# Altium schematic sheet TOP.SchDoc: TOP
size 420 x 297 mm; Author: P. Zdunek; CompanyName: WUT ISE; DrawnBy: P. Zdunek; Organization: WUT ISE; Address1: PW ISE; Address2: Nowowiejska 15/19 00-665 Warsaw; Address3: p.zdunek90@gmail.com; DocumentNumber: 1; Revision: 2; SheetNumber: 1; SheetTotal: 10; ModifiedBy: -; CheckedDate: -; DivGrp: WUT ISE; Designer: P. Zdunek; ModifiedDate: -; ProjectName: Sensor Box
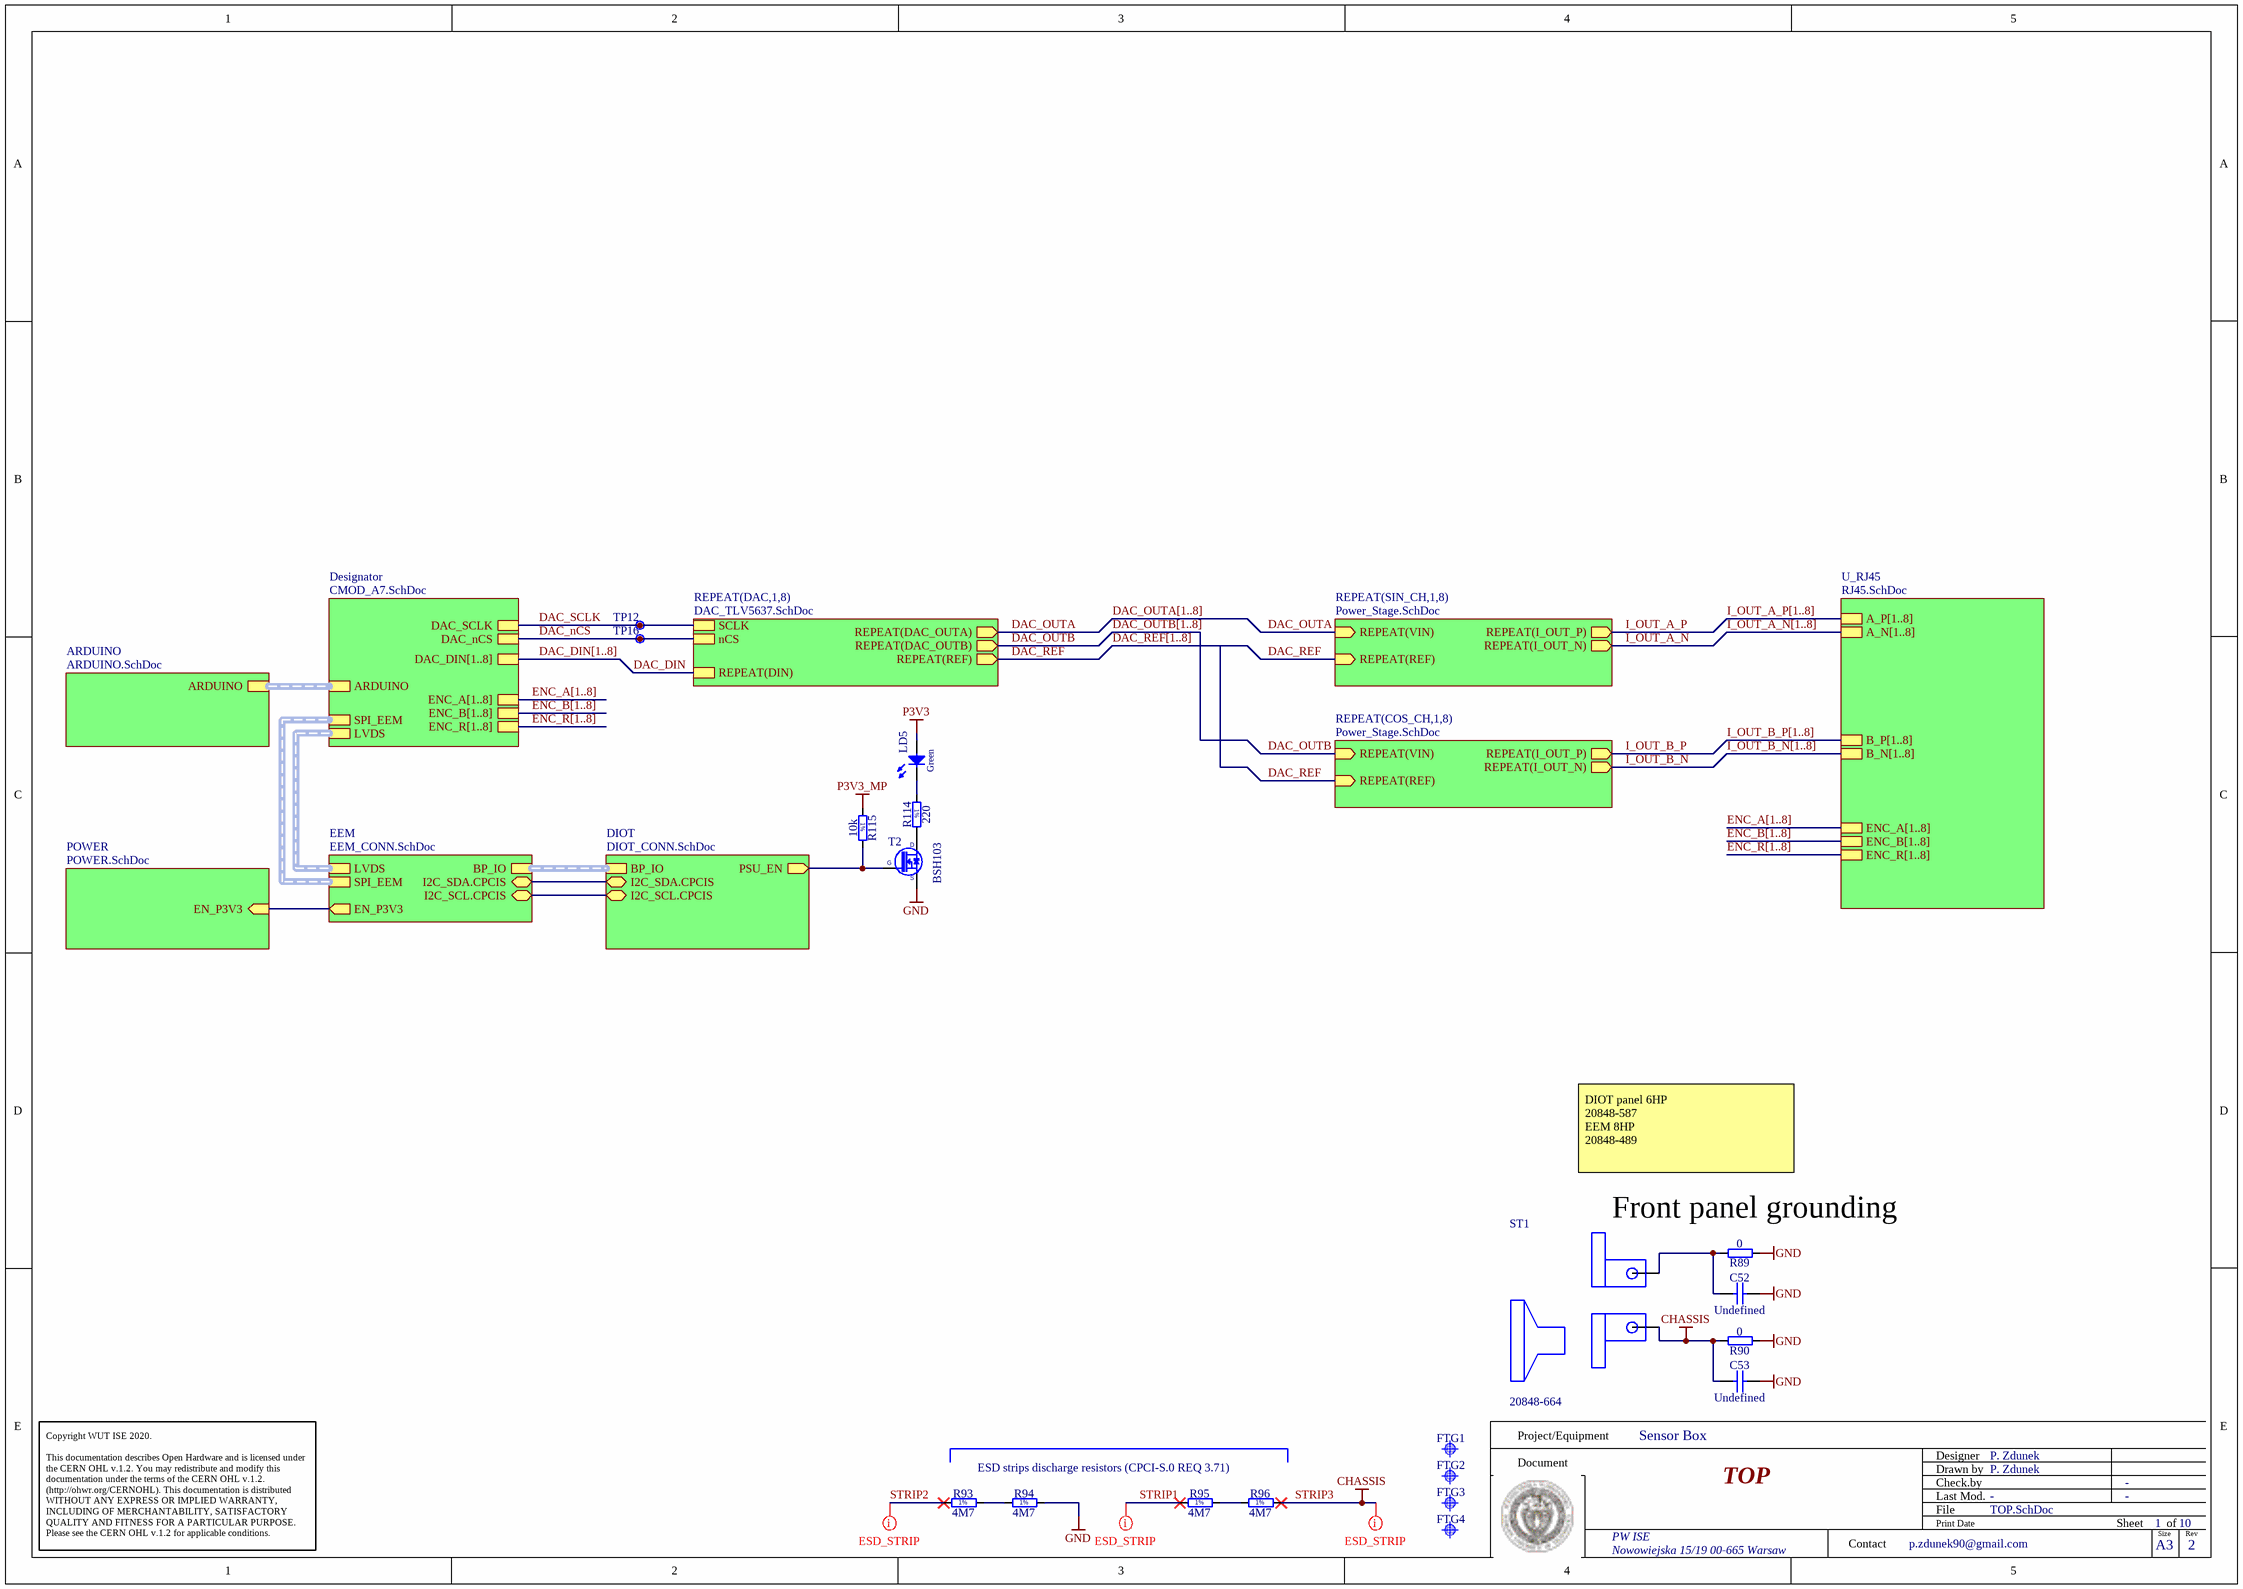
[diagram p0: TOP.SchDoc]

## Parts
C52  Undefined  [CAPC2012X135N]
C53  Undefined  [CAPC2012X135N]
FTG1  Use only in PCB  [FIDUCIAL_TOP_C100-200]  (value not drawn)  (no BOM)
FTG2  Use only in PCB  [FIDUCIAL_TOP_S100-200]  (value not drawn)  (no BOM)
FTG3  Use only in PCB  [FIDUCIAL_TOP_S100-200]  (value not drawn)  (no BOM)
FTG4  Use only in PCB  [FIDUCIAL_TOP_S100-200]  (value not drawn)  (no BOM)
LD5  Green  [LED_DIALIGHT_555-230]
R89  0  [RESC1005X40N]
R90  0  [RESC1005X40N]
R93  4M7  [RESC2113X55N]
R94  4M7  [RESC2113X55N]
R95  4M7  [RESC2113X55N]
R96  4M7  [RESC2113X55N]
R114  220  [RESC1608X55N]
R115  10k  [RESC1005X40N]
ST1  Manufacturer Part Number 2: 20848-664  [SCHROFF_PANEL_3HP_4U]  (no BOM)
T2  BSH103  [SOT95P230X110-3N]
TP12  Plated Hole  [c130h60]  (value not drawn)  (no BOM)
TP16  Plated Hole  [c130h60]  (value not drawn)  (no BOM)

## Sub-sheets
ARDUINO = ARDUINO.SchDoc: ARDUINO (harness Harness)
Designator = CMOD_A7.SchDoc: DAC_DIN[1..8], ENC_A[1..8], ENC_B[1..8], ENC_R[1..8], DAC_SCLK, DAC_nCS, ARDUINO (harness Harness), SPI_EEM (harness Harness), LVDS (harness Harness)
DIOT = DIOT_CONN.SchDoc: BP_IO (harness BP_Conn), I2C_SDA.CPCIS (bidir), I2C_SCL.CPCIS (bidir), PSU_EN (out)
EEM = EEM_CONN.SchDoc: I2C_SDA.CPCIS (bidir), I2C_SCL.CPCIS (bidir), BP_IO (harness BP_Conn), SPI_EEM (harness Harness), LVDS (harness Harness), EN_P3V3 (out)
POWER = POWER.SchDoc: EN_P3V3 (in)
REPEAT(COS_CH,1,8) = Power_Stage.SchDoc: REPEAT(I_OUT_P) (out), REPEAT(I_OUT_N) (out), REPEAT(VIN) (in), REPEAT(REF) (in)
REPEAT(DAC,1,8) = DAC_TLV5637.SchDoc: SCLK, REPEAT(DIN), nCS, REPEAT(DAC_OUTA) (out), REPEAT(DAC_OUTB) (out), REPEAT(REF) (out)
REPEAT(SIN_CH,1,8) = Power_Stage.SchDoc: REPEAT(I_OUT_P) (out), REPEAT(I_OUT_N) (out), REPEAT(VIN) (in), REPEAT(REF) (in)
U_RJ45 = RJ45.SchDoc: A_P[1..8], A_N[1..8], B_P[1..8], B_N[1..8], ENC_B[1..8], ENC_R[1..8], ENC_A[1..8]

## Nets
GND: C52.2 C53.2 R89.1 R90.1 R94.2 T2.2(S)
P3V3: LD5.2(A)
P3V3_MP: R115.1
STRIP3: C53.1 R90.2 R96.2 ST1.0  [also labelled CHASSIS]
DAC_DIN: sheet REPEAT(DAC,1,8)/REPEAT(DIN)
DAC_nCS: TP16.1 ; sheet REPEAT(DAC,1,8)/nCS, sheet Designator/DAC_nCS
DAC_OUTA: sheet REPEAT(DAC,1,8)/REPEAT(DAC_OUTA), sheet REPEAT(SIN_CH,1,8)/REPEAT(VIN)
DAC_OUTB: sheet REPEAT(DAC,1,8)/REPEAT(DAC_OUTB), sheet REPEAT(COS_CH,1,8)/REPEAT(VIN)
DAC_REF: sheet REPEAT(DAC,1,8)/REPEAT(REF), sheet REPEAT(SIN_CH,1,8)/REPEAT(REF), sheet REPEAT(COS_CH,1,8)/REPEAT(REF)
DAC_SCLK: TP12.1 ; sheet REPEAT(DAC,1,8)/SCLK, sheet Designator/DAC_SCLK
I_OUT_A_N: sheet REPEAT(SIN_CH,1,8)/REPEAT(I_OUT_N)
I_OUT_A_P: sheet REPEAT(SIN_CH,1,8)/REPEAT(I_OUT_P)
I_OUT_B_N: sheet REPEAT(COS_CH,1,8)/REPEAT(I_OUT_N)
I_OUT_B_P: sheet REPEAT(COS_CH,1,8)/REPEAT(I_OUT_P)
STRIP1: R95.1
STRIP2: R93.1
NetC52_1: C52.1 R89.2 ST1.1
NetLD5_1: LD5.1(C) R114.1
NetR93_2: R93.2 R94.1
NetR95_2: R95.2 R96.1
NetR114_2: R114.2 T2.3(D)
NetR115_2: R115.2 T2.1(G) ; sheet DIOT/PSU_EN
(unnamed): sheet EEM/I2C_SDA.CPCIS, sheet DIOT/I2C_SDA.CPCIS
(unnamed): sheet EEM/I2C_SCL.CPCIS, sheet DIOT/I2C_SCL.CPCIS
(unnamed): sheet EEM/EN_P3V3, sheet POWER/EN_P3V3

## Buses and harness runs
bus DAC_DIN[1..8] = sheet Designator/DAC_DIN[1..8]
bus DAC_OUTA[1..8]
bus DAC_OUTB[1..8]
bus DAC_REF[1..8]
bus ENC_A[1..8] = sheet Designator/ENC_A[1..8]
bus ENC_A[1..8] = sheet U_RJ45/ENC_A[1..8]
bus ENC_B[1..8] = sheet Designator/ENC_B[1..8]
bus ENC_B[1..8] = sheet U_RJ45/ENC_B[1..8]
bus ENC_R[1..8] = sheet Designator/ENC_R[1..8]
bus ENC_R[1..8] = sheet U_RJ45/ENC_R[1..8]
bus I_OUT_A_N[1..8] = sheet U_RJ45/A_N[1..8]
bus I_OUT_A_P[1..8] = sheet U_RJ45/A_P[1..8]
bus I_OUT_B_N[1..8] = sheet U_RJ45/B_N[1..8]
bus I_OUT_B_P[1..8] = sheet U_RJ45/B_P[1..8]
harness sheet ARDUINO/ARDUINO = sheet Designator/ARDUINO
harness sheet Designator/LVDS = sheet EEM/LVDS
harness sheet Designator/SPI_EEM = sheet EEM/SPI_EEM
harness sheet DIOT/BP_IO = sheet EEM/BP_IO

## Layout directives
net class ESD_STRIP: STRIP1, STRIP2, STRIP3

## Notes on the sheet
- DIOT panel 6HP
  20848-587
  EEM 8HP
  20848-489
- (near R89) Front panel grounding
- ESD strips discharge resistors (CPCI-S.0 REQ 3.71)
- Project/Equipment
- Document
- Designer
- Drawn by
- Check.by
- Copyright WUT ISE 2020.
  This documentation describes Open Hardware and is licensed under the CERN OHL v.1.2. You may redistribute and modify this documentation under the terms of the CERN OHL v.1.2. (http://ohwr.org/CERNOHL). This documentation is distributed WITHOUT ANY EXPRESS OR IMPLIED WARRANTY, INCLUDING OF MERCHANTABILITY, SATISFACTORY QUALITY AND FITNESS FOR A PARTICULAR PURPOSE. Please see the CERN OHL v.1.2 for applicable conditions.
- Contact
- File
- Last Mod.
- Print Date
- Sheet
- Size
- A3
- of
- Rev
- (in symbol R0402_10K_1%_0.0625W_100PPM) 1%
- (in symbol R0603_220R_1%_0.1W_100PPM) 1%
- (in symbol R0805_4M7_1%_0.125W_100PPM_VISHAY_CRCW e3) 1%

## Library data of the parts
C52 C53 = CC0805_NO-VALUE: Non-polarised capacitor; Part Description: Reserved Footprint For 0805(2012) Chip Ceramic Capacitor; Mounted: No; Part Number: CC0805_NO-VALUE; Component Kind: Standard; Component Type: Standard; Pin Count: 2; Value: Undefined; Status: None; Manufacturer: Undefined; Manufacturer Part Number: CC0805_NO-VALUE; Case: 0805; Socket: No; SMD: Yes; Sense: No; Manufacturer1 ComponentHeight: 1.35mm; HelpURL: Undefined; Author: CERN DEM JLC; CreateDate: 10.12.2008; LatestRevisionDate: 11.09.2013
FTG1 = FIDUCIAL_TARGET_C100-200: Fiducial Target; Part Description: Round Fiducial Target, Top Layer, 1.0mm, Top Solder 2.0mm, Keepout =2.0mm; Mounted: No; Part Number: FIDUCIAL_TARGET_C100-200; Component Type: Standard (No BOM); Pin Count: 1; Family: Fiducial; Socket: No; SMD: Yes; Sense: No; Status: None; ComponentHeight: 0mm; HelpURL: Undefined; Author: CERN DEM JLC; CreateDate: 09.02.2010; LatestRevisionDate: 04.04.2012; PackageDescription: Round Fiducial Target, Top Layer, 1.0mm, Top Solder 2.0mm, Keepout =2.0mm
FTG2-FTG4 = FIDUCIAL_TARGET_S100-200: Fiducial Target; Part Description: Square Fiducial Target, Top Layer, 1.0mm, Top Solder 2.0mm, Keepout =2.0mm; Mounted: No; Part Number: FIDUCIAL_TARGET_S100-200; Component Type: Standard (No BOM); Pin Count: 1; Family: Fiducial; Socket: No; SMD: Yes; Sense: No; Status: None; ComponentHeight: 0mm; HelpURL: Undefined; Author: CERN DEM JLC; CreateDate: 09.02.2010; LatestRevisionDate: 04.04.2012; PackageDescription: Square Fiducial Target, Top Layer, 1.0mm, Top Solder 2.0mm, Keepout =2.0mm
LD5 = LED_DIALIGHT_555-2301F: LED Green 1C 2A; Part Description: Single 2mm Green LED CBI® Circuit Board Indicator; PressFit: No; Bonding: No; Part Number: LED_DIALIGHT_555-2301F; Component Kind: Standard; Component Type: Standard; Color: Green; PackageDescription: Single 2mm Green LED, Body 5.08x2.54mm, Pin spacing 2.54mm; Manufacturer: DIALIGHT; Manufacturer Part Number: 555-2301F; Pin Count: 2; Mounted: Yes; Socket: No; SMD: No; Sense: No; ComponentHeight: 6.35mm; HelpURL: \\cern.ch\dfs\Applications\Altium\Datasheets\LED_DIALIGHT_555-2301F.pdf; Author: CERN DEM JMW; CreateDate: 22.09.2008; LatestRevisionDate: 17.03.2010
R89 R90 = R0402_0R_JUMPER: Resistor; Part Description: 1A (0.05R Max DC Resistance) Zero Ohm Jumper; Manufacturer: GENERIC; Manufacturer1 Part Number: 232270591001L; PressFit: No; Part Number: R0402_0R_JUMPER; Component Kind: Standard; Component Type: Standard; Pin Count: 2; Value: 0; Status: Not Recommended; Manufacturer Part Number: R0402_0R_JUMPER; Case: 0402; Mounted: Yes; Sense: No; Socket: No; SMD: Yes; Manufacturer1 Example: YAGEO PHYCOMP; Manufacturer1 ComponentHeight: 0.4mm; HelpURL: \\cern.ch\dfs\Applications\Altium\Datasheets\R0402_Phycomp_RC0402.pdf; Author: CERN DEM JLC; CreateDate: 03/12/2007; LatestRevisionDate: 17/10/2012
R93-R96 = R0805_4M7_1%_0.125W_100PPM_VISHAY_CRCW e3: Resistor - 1%; Part Description: 150V, Standard Thick Film Chip Resistor; Manufacturer: VISHAY; Manufacturer Part Number: CRCW08054M70FKEA; Power: 0.125W; TC: ±100ppm/°C; PressFit: No; Part Number: R0805_4M7_1%_0.125W_100PPM_VISHAY_CRCW e3; Component Kind: Standard; Component Type: Standard; Pin Count: 2; Value: 4M7; Status: None; Tolerance: ±1%; Case: 0805; Mounted: Yes; Sense: No; Socket: No; SMD: Yes; ComponentHeight: 0.5mm; HelpURL: \\cern.ch\dfs\Applications\Altium\Datasheets\R0805_VISHAY_CRCW e3.pdf; Author: CERN DEM BR; CreateDate: 27/05/2019; LatestRevisionDate: 27/05/2019
R114 = R0603_220R_1%_0.1W_100PPM: Resistor - 1%; Part Description: General Purpose Thick Film Chip Resistor; Manufacturer: GENERIC; Manufacturer1 Part Number: NRC06F2200TRF; Power: 0.1W; TC: ±100ppm/°C; Part Number: R0603_220R_1%_0.1W_100PPM; Component Kind: Standard; Component Type: Standard; Pin Count: 2; Value: 220; Status: Preferred; Tolerance: ±1%; Manufacturer Part Number: R0603_220R_1%_0.1W_100PPM; Case: 0603; Mounted: Yes; Sense: No; Socket: No; SMD: Yes; Manufacturer1 Example: NIC COMPONENT; Manufacturer1 ComponentHeight: 0.55mm; HelpURL: \\cern.ch\dfs\Applications\Altium\Datasheets\R0603_NIC_NRC.pdf; Author: CERN DEM JLC; CreateDate: 03.12.2007; LatestRevisionDate: 13.03.2008
R115 = R0402_10K_1%_0.0625W_100PPM: Resistor - 1%; Part Description: General Purpose Thick Film Chip Resistor; Manufacturer: GENERIC; Manufacturer1 Part Number: 232270671003L; TC: ±100ppm/°C; PressFit: No; Part Number: R0402_10K_1%_0.0625W_100PPM; Component Kind: Standard; Component Type: Standard; Pin Count: 2; Value: 10k; Status: Not Recommended; Power: 0.0625W; Tolerance: ±1%; Manufacturer Part Number: R0402_10K_1%_0.0625W_100PPM; Case: 0402; Mounted: Yes; Sense: No; Socket: No; SMD: Yes; Manufacturer1 Example: YAGEO PHYCOMP; Manufacturer1 ComponentHeight: 0.4mm; HelpURL: \\cern.ch\dfs\Applications\Altium\Datasheets\R0402_Phycomp_RC0402.pdf; Author: CERN DEM JLC; CreateDate: 03.12.2007; LatestRevisionDate: 17.10.2012
ST1 = SCHROFF_PANEL_3U_4HP: Schroff 3HP 4U EUROCARD Panel Kit; Manufacturer Part Number: 20818-017; Manufacturer: Schroff
T2 = BSH103: N-CHANNEL MOSFET WITH DIODE; Part Description: 30V 850mA N-Channel Enhancement Mode Field-Effect Transistor; Manufacturer: NEXPERIA; PressFit: No; Bonding: No; Part Number: BSH103; Component Kind: Standard; Component Type: Standard; Device: BSH103; PackageDescription: SOT23, 0.95mm Pitch; 3 Pin, 1.30mm W X 2.90mm L X 1.10mm H body, IPC Medium Density; Manufacturer Part Number: BSH103; Pin Count: 3; Case: SOT23-3; Mounted: Yes; Socket: No; SMD: Yes; Sense: No; ComponentHeight: 1.1mm; HelpURL: \\cern.ch\dfs\Applications\Altium\Datasheets\BSH103.pdf; Author: CERN DEM JLC; CreateDate: 16.03.2010; LatestRevisionDate: 20.06.2017
TP12 TP16 = PLATED_HOLE0.6_PAD1.3: Single Terminal Socket; Part Description: Plated Through Hole: Hole Dia.=0.6mm Pad Dia.=1.3mm; Mounted: No; Part Number: PLATED_HOLE0.6_PAD1.3; Component Type: Standard (No BOM); Pin Count: 1; Family: Plated Hole; Socket: No; SMD: No; Sense: No; Status: None; ComponentHeight: 0mm; HelpURL: Undefined; Author: CERN DEM MR; CreateDate: 02/03/2016; LatestRevisionDate: 02/03/2016; PackageDescription: Plated Through Hole: Hole Dia.=0.6mm Pad Dia.=1.3mm